# Altium schematic sheet TSOP1838.SchDoc
size A; SheetNumber: 5; SheetTotal: 9
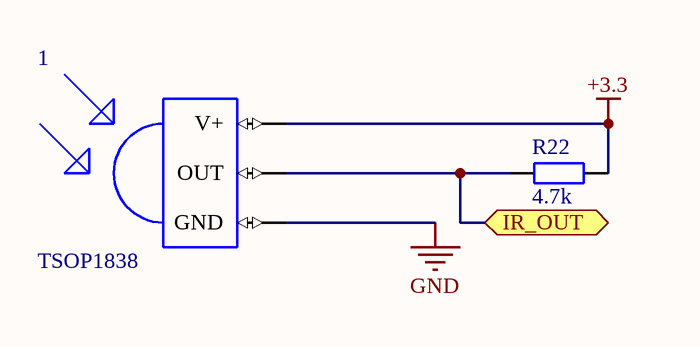
[diagram p0: TSOP1838.SchDoc]

## Parts
1  TSOP1838  [TSOP18XX]
R22  4.7k  [tro smd 0603]

## Ports
IR_OUT (bidir)

## Nets
+3.3: 1.VCC(V+) R22.2
GND: 1.GND
IR_OUT: 1.OUT R22.1 ; port IR_OUT

## Library data of the parts
1 = TSOP1838: IR Remote Receiver 38KHz 35m 3-Pin; MF: Vishay; Price: None; SnapEDA_Link: https://www.snapeda.com/parts/TSOP1838/Vishay/view-part/561684/?ref=snap; Availability: Unavailable; Value: *; MP: TSOP1838; Package: None
R22 = Tro 0603 5% 4.7k: Dán; Don_Vi: Con; So_Chan: 2; Ten_Linh_Kien: Trở 0603 5% 4.7k; Ma_Hang: MH006327; Chung_Loai: Dán; Kieu_Chan: *